# EAGLE design A601 (EAGLE 6.6.0)
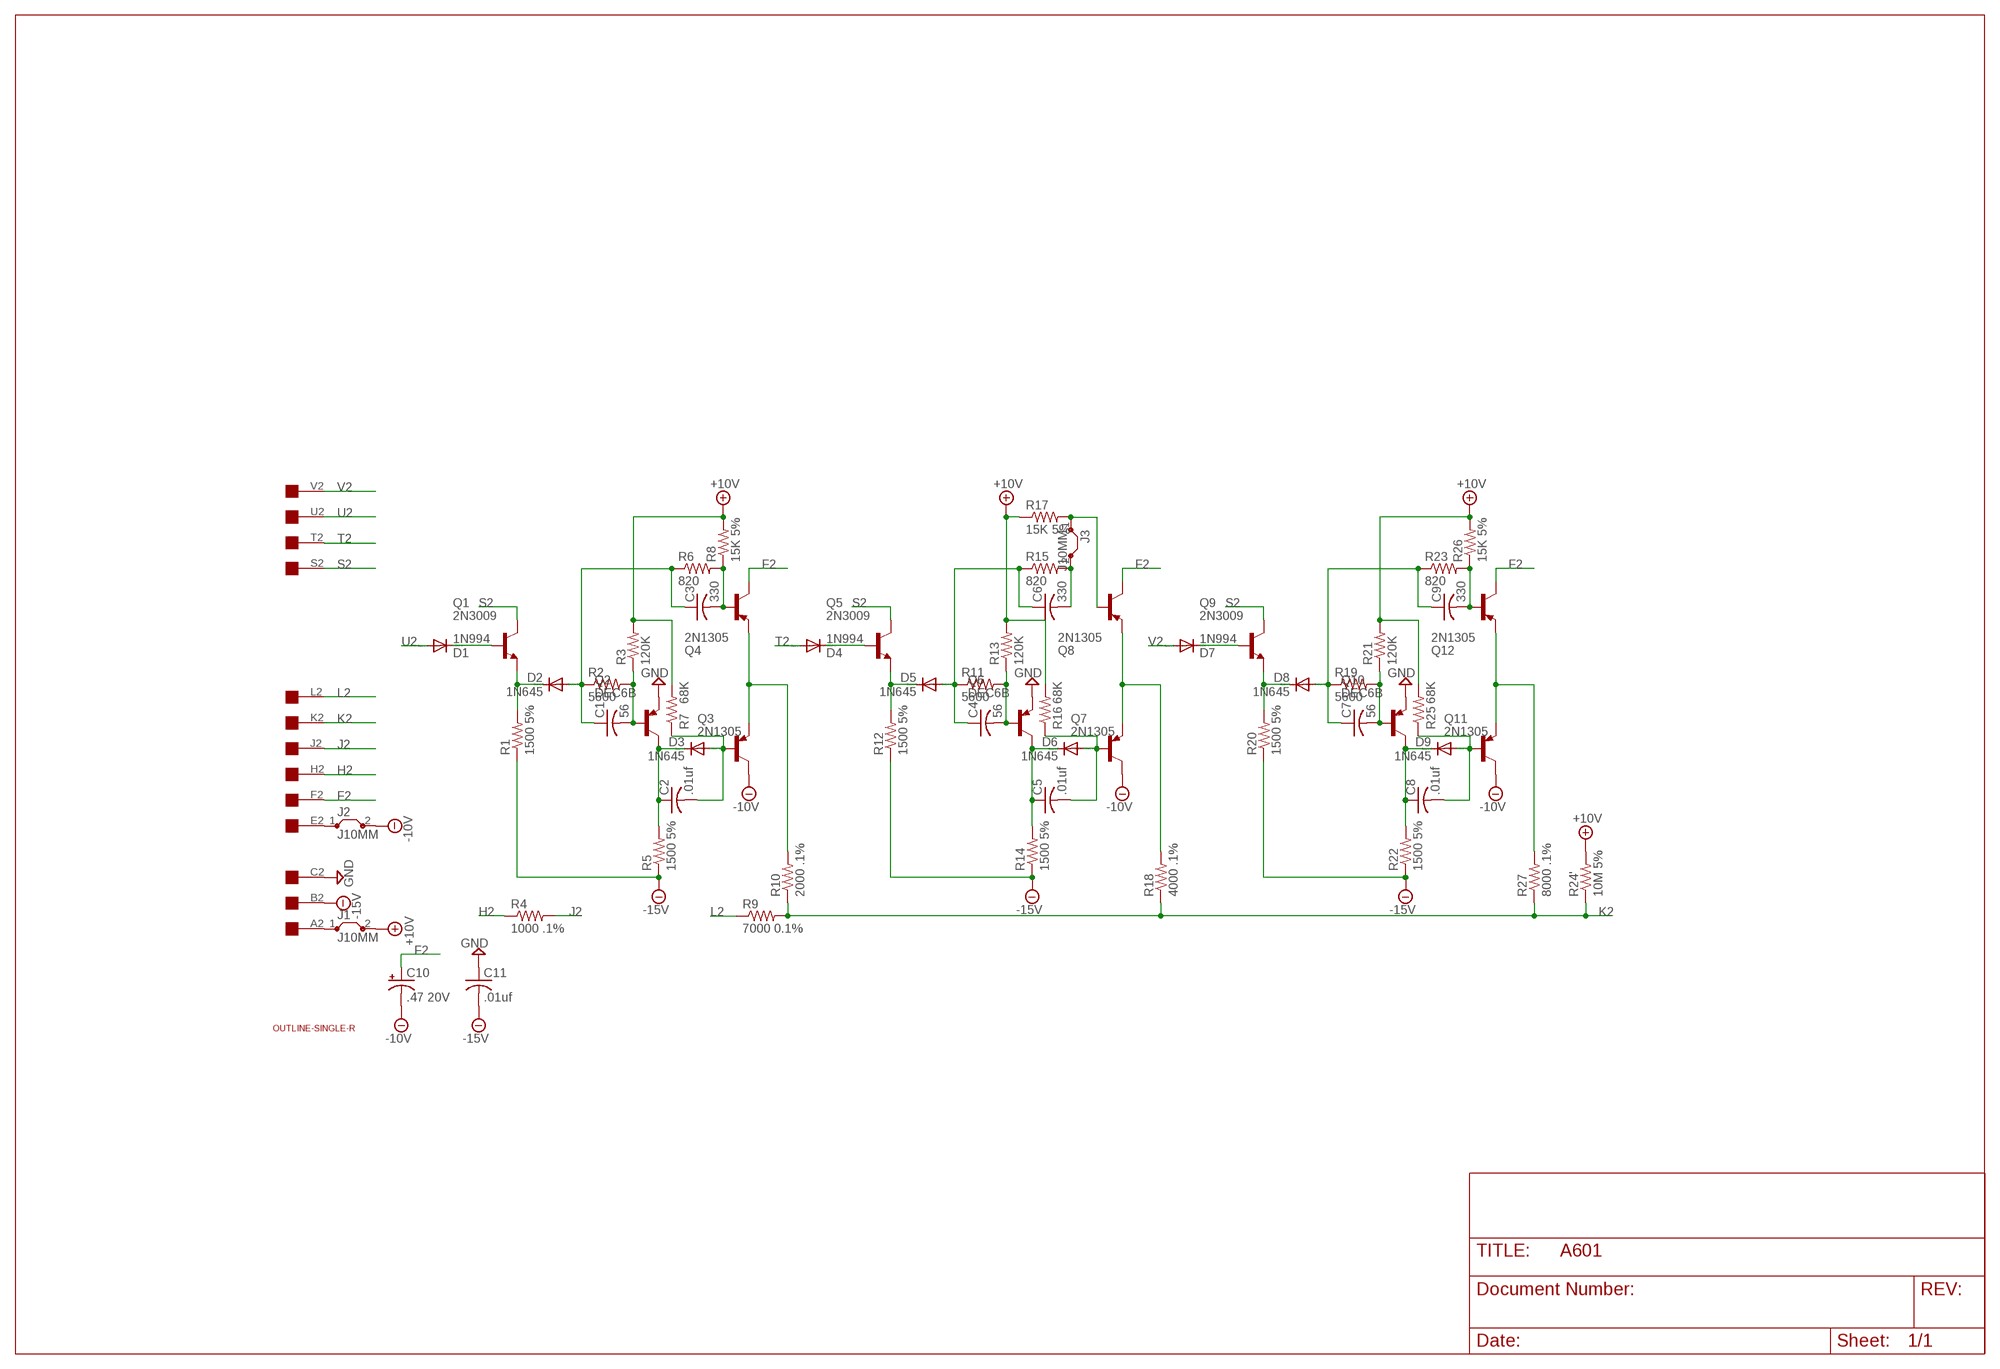
[diagram p0: schematic, sheet 1]

## Parts
C1  56  C-US075-032X103  [C075-032X103]
C2  .01uf  C-US050-025X075  [C050-025X075]
C3  330  C-US102-043X133  [C102-043X133]
C4  56  C-US075-032X103  [C075-032X103]
C5  .01uf  C-US050-025X075  [C050-025X075]
C6  330  C-US102-043X133  [C102-043X133]
C7  56  C-US075-032X103  [C075-032X103]
C8  .01uf  C-US050-025X075  [C050-025X075]
C9  330  C-US102-043X133  [C102-043X133]
C10  .47 20V  CPOL-USE22-6AXIAL  [E22-6]
C11  .01uf  C-US050-025X075  [C050-025X075]
D1  1N994  1N4148DO35-10  [DO35-10]
D2  1N645  1N4148DO35-10  [DO35-10]
D3  1N645  1N4148DO35-10  [DO35-10]
D4  1N994  1N4148DO35-10  [DO35-10]
D5  1N645  1N4148DO35-10  [DO35-10]
D6  1N645  1N4148DO35-10  [DO35-10]
D7  1N994  1N4148DO35-10  [DO35-10]
D8  1N645  1N4148DO35-10  [DO35-10]
D9  1N645  1N4148DO35-10  [DO35-10]
J1  J10MM  [10]
J2  J10MM  [10]
J3  J10MM  [10]
Q1  2N3009  2N1613-NPN-TO39-EBC  [TO39]
Q2  DEC6B  2N2904A  [TO39]
Q3  2N1305  2N2904A  [TO39]
Q4  2N1305  2N2904A  [TO39]
Q5  2N3009  2N1613-NPN-TO39-EBC  [TO39]
Q6  DEC6B  2N2904A  [TO39]
Q7  2N1305  2N2904A  [TO39]
Q8  2N1305  2N2904A  [TO39]
Q9  2N3009  2N1613-NPN-TO39-EBC  [TO39]
Q10  DEC6B  2N2904A  [TO39]
Q11  2N1305  2N2904A  [TO39]
Q12  2N1305  2N2904A  [TO39]
R1  1500 5%  R-US_0207/10  [0207/10]
R2  5600  R-US_0207/10  [0207/10]
R3  120K  R-US_0207/10  [0207/10]
R4  1000 .1%  R-US_0309/12  [0309/12]
R5  1500 5%  R-US_0207/10  [0207/10]
R6  820  R-US_0207/10  [0207/10]
R7  68K  R-US_0207/10  [0207/10]
R8  15K 5%  R-US_0207/10  [0207/10]
R9  7000 0.1%  R-US_0309/12  [0309/12]
R10  2000 .1%  R-US_0309/12  [0309/12]
R11  5600  R-US_0207/10  [0207/10]
R12  1500 5%  R-US_0207/10  [0207/10]
R13  120K  R-US_0207/10  [0207/10]
R14  1500 5%  R-US_0207/10  [0207/10]
R15  820  R-US_0207/10  [0207/10]
R16  68K  R-US_0207/10  [0207/10]
R17  15K 5%  R-US_0207/10  [0207/10]
R18  4000 .1%  R-US_0309/12  [0309/12]
R19  5600  R-US_0207/10  [0207/10]
R20  1500 5%  R-US_0207/10  [0207/10]
R21  120K  R-US_0207/10  [0207/10]
R22  1500 5%  R-US_0207/10  [0207/10]
R23  820  R-US_0207/10  [0207/10]
R24'  10M 5%  R-US_0207/10  [0207/10]
R25  68K  R-US_0207/10  [0207/10]
R26  15K 5%  R-US_0207/10  [0207/10]
R27  8000 .1%  R-US_0309/12  [0309/12]
U$2  OUTLINE-SINGLE-R  [SINGLE-R]
U$3  EDGE-1  [EDGE-CON1]

## Nets
+10V: J1.2 R3.2 R7.2 R8.2 R13.2 R16.2 R17.1 R21.2 R24'.2 R25.2 R26.2
-10V: C10.- J2.2 Q3.3(C) Q7.3(C) Q11.3(C)
-15V: C11.2 R1.1 R5.1 R12.1 R14.1 R20.1 R22.1 U$3.B2
F2: C10.+ Q4.3(C) Q8.3(C) Q12.3(C) U$3.F2
GND [supply]: C11.1 Q2.1(E) Q6.1(E) Q10.1(E) U$3.C2
H2: R4.1 U$3.H2
J2: R4.2 U$3.J2
K2: R9.2 R10.1 R18.1 R24'.1 R27.1 U$3.K2
L2: R9.1 U$3.L2
N$1: D1.C Q1.2(B)
N$2: D2.C Q1.1(E) R1.2
N$3: C1.1 C3.1 D2.A R2.1 R6.1
N$4: C1.2 Q2.2(B) R2.2 R3.1
N$5: C3.2 Q4.2(B) R6.2 R8.1
N$6: C2.1 D3.C Q2.3(C) R5.2
N$7: C2.2 D3.A Q3.2(B) R7.1
N$8: Q3.1(E) Q4.1(E) R10.2
N$9: J2.1 U$3.E2
N$10: D4.C Q5.2(B)
N$11: D5.C Q5.1(E) R12.2
N$12: C4.1 C6.1 D5.A R11.1 R15.1
N$13: C4.2 Q6.2(B) R11.2 R13.1
N$14: C6.2 J3.2 R15.2
N$15: C5.1 D6.C Q6.3(C) R14.2
N$16: C5.2 D6.A Q7.2(B) R16.1
N$17: Q7.1(E) Q8.1(E) R18.2
N$18: D7.C Q9.2(B)
N$19: D8.C Q9.1(E) R20.2
N$20: C7.1 C9.1 D8.A R19.1 R23.1
N$21: C7.2 Q10.2(B) R19.2 R21.1
N$22: C9.2 Q12.2(B) R23.2 R26.1
N$23: C8.1 D9.C Q10.3(C) R22.2
N$24: C8.2 D9.A Q11.2(B) R25.1
N$25: Q11.1(E) Q12.1(E) R27.2
N$26: J1.1 U$3.A2
N$27: J3.1 Q8.2(B) R17.2
S2: Q1.3(C) Q5.3(C) Q9.3(C) U$3.S2
T2: D4.A U$3.T2
U2: D1.A U$3.U2
V2: D7.A U$3.V2
Unconnected: U$3.D2 U$3.M2 U$3.N2 U$3.P2 U$3.R2

## Library data of the parts
C1-C9 C11 = rcl:C-US: CAPACITOR, American symbol
C10 = rcl:CPOL-US: POLARIZED CAPACITOR, American symbol
D1-D9 = diode:1N4148: DIODE high speed (Philips)
J1-J3 = jumper:J: Bridge
Q1 Q5 Q9 = transistor:*-NPN-: NPN Transistror BF959 corrected 2008.03.06
Q2-Q4 Q6-Q8 Q10-Q12 = transistor-pnp:2N2904*: PNP Transistror
R1-R23 R24' R25-R27 = rcl:R-US_: RESISTOR, American symbol
U$2 = dec-con:OUTLINE-*: Board outlines for DEC boards.
U$3 = dec-con:EDGE-1: Single-Sided DEC Edge Connector -- (side 2)

## Board
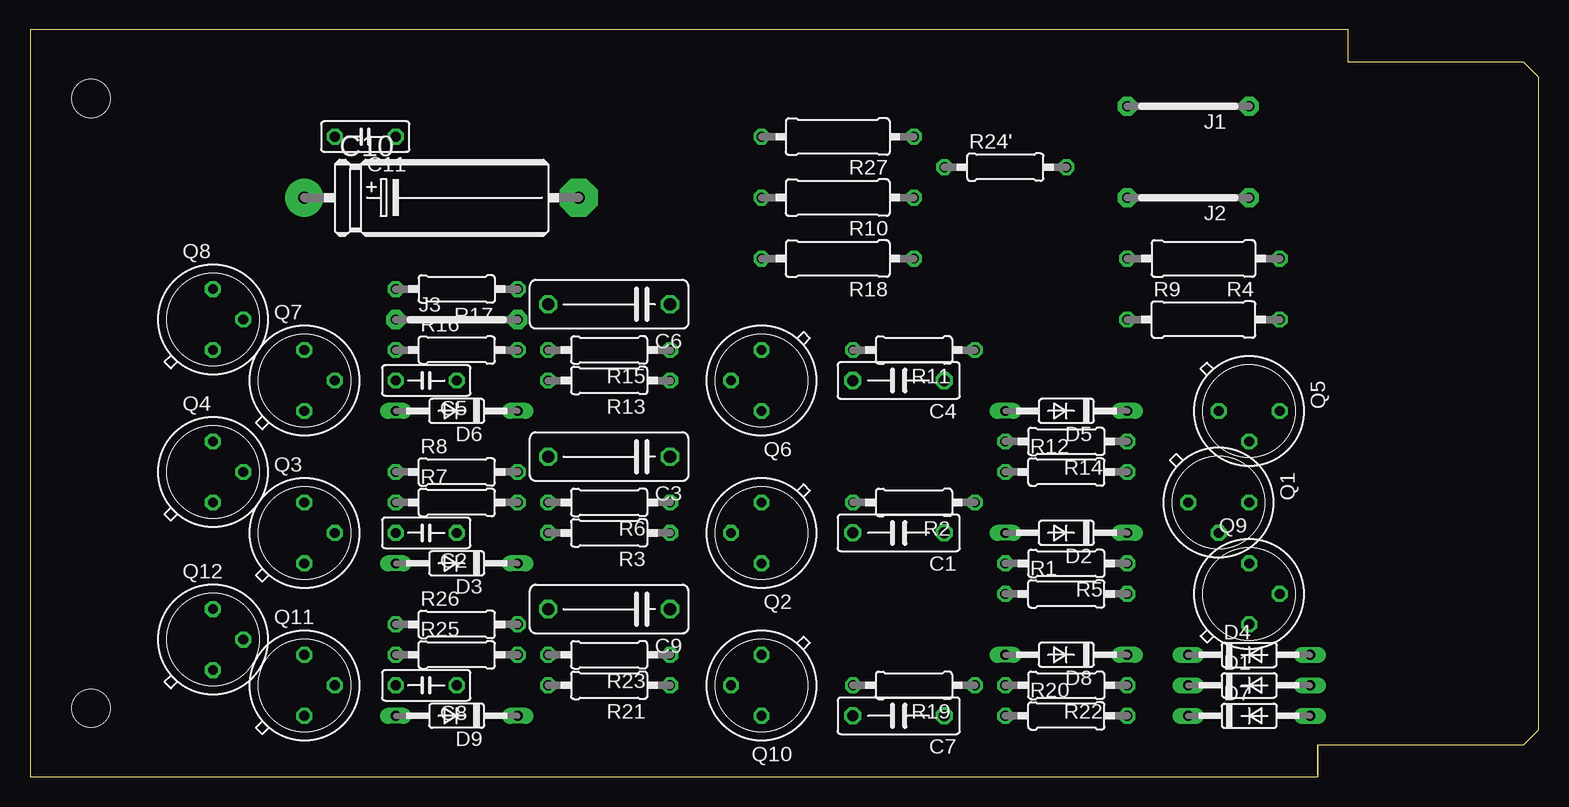
[diagram p1: board, top side]
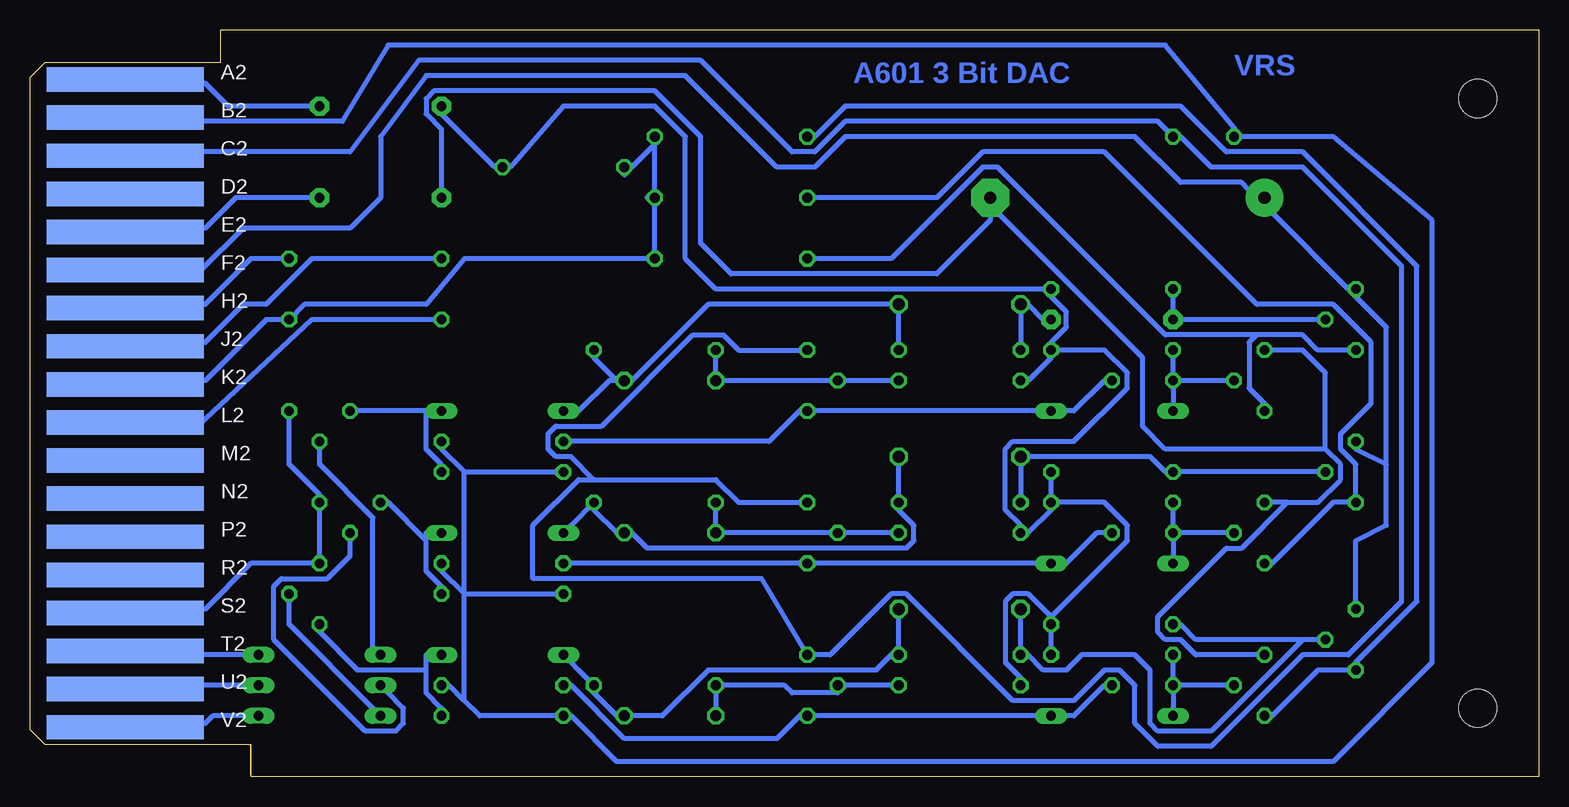
[diagram p2: board, bottom side, seen from below]

Size 125.73 x 62.23 mm. Coordinates in mm from the lower left corner, seen from the top.
Copper layers (1+16): Top 0.035mm / dielectric 1.5mm / Bottom 0.035mm
Design rules "16mils": minimum track width 16mil, minimum drill 32mil, track to track 15mil, track to pad 10mil, pad to pad 10mil, via to via 10mil, smd to smd 10mil, copper to edge 13mil, drill to drill 10mil, minimum pad ring 10mil, minimum via ring 8mil, stop-mask expansion 0mil, vias tented up to drill 0mil, thermal gap 10mil

### Footprints (pad centres in the part's own frame; a part is rotated, then mirrored left to right if it is on the bottom)
C075-032X103 = drill 0.914 octagon: 1 -3.81,0; 2 3.81,0
C050-025X075 = drill 0.813 octagon: 1 -2.54,0; 2 2.54,0
C102-043X133 = drill 1.016 octagon: 1 -5.08,0; 2 5.08,0
E22-6 = drill 1.016 pad 3.15: + -11.43,0 | drill 1.016 pad 3.15 octagon: - 11.43,0
DO35-10 = drill 0.813 long: A 5.08,0; C -5.08,0
10 = drill 0.813 pad 1.6 octagon: 1 -5.08,0; 2 5.08,0
TO39 = drill 0.813 octagon: 1 0,-2.54; 2 2.54,0; 3 0,2.54
0207/10 = drill 0.813 octagon: 1 -5.08,0; 2 5.08,0
0309/12 = drill 0.813 octagon: 1 -6.35,0; 2 6.35,0
SINGLE-R = hole 3.175: 5.08,5.715; 5.08,56.515
EDGE-CON1 = smd 13.106 x 2.032 bottom: A2 7.938,4.128; B2 7.938,7.303; C2 7.938,10.477; D2 7.938,13.652; E2 7.938,16.828; F2 7.938,20.003; H2 7.938,23.177; J2 7.938,26.352; K2 7.938,29.527; L2 7.938,32.703; M2 7.938,35.877; N2 7.938,39.053; P2 7.938,42.227; R2 7.938,45.403; S2 7.938,48.578; T2 7.938,51.752; U2 7.938,54.928; V2 7.938,58.102

### Placement (x,y rotation side)
C1  72.39,20.32 180 top
C2  33.02,20.32 180 top
C3  48.26,26.67 180 top
C4  72.39,33.02 180 top
C5  33.02,33.02 180 top
C6  48.26,39.37 180 top
C7  72.39,5.08 180 top
C8  33.02,7.62 180 top
C9  48.26,13.97 180 top
C10  34.29,48.26 0 top
C11  27.94,53.34 180 top
D1  101.6,7.62 0 top
D2  86.36,20.32 180 top
D3  35.56,17.78 180 top
D4  101.6,10.16 0 top
D5  86.36,30.48 180 top
D6  35.56,30.48 180 top
D7  101.6,5.08 0 top
D8  86.36,10.16 180 top
D9  35.56,5.08 180 top
J1  96.52,55.88 180 top
J2  96.52,48.26 180 top
J3  35.56,38.1 0 top
Q1  99.06,22.86 270 top
Q2  60.96,20.32 180 top
Q3  22.86,20.32 0 top
Q4  15.24,25.4 0 top
Q5  101.6,30.48 270 top
Q6  60.96,33.02 180 top
Q7  22.86,33.02 0 top
Q8  15.24,38.1 0 top
Q9  101.6,15.24 0 top
Q10  60.96,7.62 180 top
Q11  22.86,7.62 0 top
Q12  15.24,11.43 0 top
R1  86.36,15.24 0 top
R2  73.66,22.86 180 top
R3  48.26,20.32 180 top
R4  97.79,43.18 180 top
R5  86.36,17.78 180 top
R6  48.26,22.86 180 top
R7  35.56,22.86 0 top
R8  35.56,25.4 0 top
R9  97.79,38.1 0 top
R10  67.31,48.26 180 top
R11  73.66,35.56 180 top
R12  86.36,25.4 0 top
R13  48.26,33.02 180 top
R14  86.36,27.94 180 top
R15  48.26,35.56 180 top
R16  35.56,35.56 0 top
R17  35.56,40.64 180 top
R18  67.31,43.18 180 top
R19  73.66,7.62 180 top
R20  86.36,5.08 0 top
R21  48.26,7.62 180 top
R22  86.36,7.62 180 top
R23  48.26,10.16 180 top
R24'  81.28,50.8 0 top
R25  35.56,10.16 0 top
R26  35.56,12.7 0 top
R27  67.31,53.34 180 top
U$2  0,0 0 top
U$3  125.73,62.23 180 top

### Tracks (layer width: path | path; a pad name or v marks a point on that pad's centre or on a via)
+10V
  Bottom 0.406: R25.2 40.64,10.79 40.64,12.06 R26.2 | 40.64,13.34 42.55,15.24 43.81,15.24 44.45,14.61 44.45,9.53 43.18,8.26 R21.2 | R26.2 40.64,13.34 | R7.2 40.64,23.5 40.64,24.77 R8.2 | R7.2 40.64,22.23 42.55,20.32 R3.2 43.18,20.95 44.45,22.23 44.45,27.3 43.81,27.94 38.73,27.94 34.29,32.38 34.29,33.66 36.2,35.56 40.01,35.56 R16.2 | R13.2 42.55,33.02 40.64,34.92 R16.2 | R16.2 40.64,36.2 39.37,37.47 39.37,38.73 40.64,40.01 R17.1 41.27,40.64 55.24,40.64 55.88,40.64 68.58,40.64 71.12,43.18 71.12,53.34 73.66,55.88 81.28,55.88 85.72,50.8 R24'.2 87,50.8 91.44,55.24 J1.2 | 40.64,13.34 34.29,19.68 34.29,20.95 36.2,22.86 40.01,22.86 R7.2 | R26.2 40.64,13.34
-10V
  Bottom 0.406: 17.78,27.3 31.11,27.3 33.02,29.21 33.02,34.92 45.09,46.99 C10.- 45.72,46.35 50.16,41.91 67.31,41.91 69.85,44.45 69.85,53.34 73.66,57.15 92.08,57.15 92.71,56.52 92.71,55.24 91.44,53.98 J2.2 | 17.78,27.3 16.51,26.04 16.51,24.77 18.41,22.86 20.95,22.86 | 20.95,22.86 Q3.3 | Q11.3 28.57,10.16 29.84,11.43 31.11,11.43 31.75,12.06 31.75,13.34 26.04,19.05 24.77,19.05 20.95,22.86 | 17.78,27.3 17.78,33.66 19.68,35.56 Q7.3
-15V
  Bottom 0.406: 89.53,6.35 90.81,7.62 R22.1 | 89.53,6.35 88.27,5.08 R20.1 80.64,5.08 76.83,1.27 17.14,1.27 8.89,9.53 8.89,46.35 17.14,53.34 24.77,53.34 | 89.53,15.24 91.44,17.14 R5.1 | 89.53,6.35 89.53,15.24 | 89.53,25.4 91.44,27.3 R14.1 | 89.53,15.24 89.53,25.4 | 24.77,53.34 31.11,60.96 95.89,60.96 99.69,54.61 111.76,54.61 U$3.B2 | 89.53,15.24 R1.1 | 89.53,25.4 R12.1 | 24.77,53.34 C11.2
F2
  Bottom 0.406: Q12.3 15.24,19.68 12.7,20.95 12.7,26.04 | 12.7,26.04 15.24,27.3 Q4.3 | 12.7,26.04 12.7,37.47 15.24,40.01 Q8.3 15.88,40.64 22.23,46.99 C10.+ 24.13,48.9 24.77,49.53 29.84,49.53 33.66,53.34 57.78,53.34 60.33,50.8 63.5,50.8 71.12,58.42 92.71,58.42 96.52,53.34 96.52,48.26 99.06,45.72 107.95,45.72 111.48,42.19 U$3.F2
GND
  Bottom 0.406: U$3.C2 111.76,52.07 99.06,52.07 93.34,59.69 69.85,59.69 62.23,52.07 60.33,52.07 57.78,54.61 31.75,54.61 C11.1 29.84,53.34 27.3,50.8 19.68,50.8 11.43,42.55 11.43,14.61 15.88,10.16 19.68,10.16 27.3,2.54 31.75,2.54 33.66,4.45 33.66,7.62 34.92,8.89 36.2,8.89 38.73,6.35 43.81,6.35 52.7,15.24 53.98,15.24 59.05,10.16 Q10.1 64.77,16.51 83.82,16.51 83.82,20.95 80.01,24.77 78.74,24.77 | Q2.1 66.67,22.86 68.58,24.77 78.74,24.77 | Q6.1 66.67,35.56 67.94,36.83 70.48,36.83 78.11,29.21 81.92,29.21 82.55,28.57 82.55,27.3 81.92,26.67 80.64,26.67 78.74,24.77
H2
  Bottom 0.406: R4.1 107.31,43.18 111.12,39.37 U$3.H2
J2
  Bottom 0.406: R4.2 102.23,43.18 106.05,39.37 107.95,39.37 111.12,36.2 U$3.J2
K2
  Bottom 0.406: 73.66,47.62 73.66,52.7 | 76.2,50.16 R24'.1 75.56,50.8 73.66,52.7 | 74.3,48.26 R10.1 R18.1 89.53,43.18 92.71,39.37 102.87,39.37 R9.2 106.05,38.1 111.12,33.02 U$3.K2 | 73.66,52.7 R27.1
L2
  Bottom 0.406: R9.1 102.23,38.1 111.76,29.21 U$3.L2
N$1
  Bottom 0.406: D1.C 95.89,6.99 94.61,5.71 94.61,4.45 95.25,3.81 97.79,3.81 105.41,11.43 105.41,15.88 104.78,16.51 100.97,16.51 99.06,18.41 99.06,19.68 Q1.2
N$2
  Bottom 0.406: 92.71,19.68 92.71,20.32 D2.C | 92.71,19.68 92.71,17.14 91.44,15.88 R1.2 | 92.71,19.68 95.89,22.86 Q1.1
N$3
  Bottom 0.406: C3.1 53.34,26.04 53.34,23.5 R6.1 53.34,22.23 52.07,20.95 52.07,19.68 52.7,19.05 74.3,19.05 75.56,20.32 C1.1 76.83,20.32 78.74,22.23 R2.1 80.64,20.95 D2.A
N$4
  Bottom 0.406: R2.2 68.58,22.23 68.58,20.95 C1.2 67.94,20.32 59.05,20.32 Q2.2 57.78,20.32 53.98,20.32 R3.1
N$5
  Bottom 0.406: R6.2 43.18,23.5 43.18,26.04 C3.2 42.55,26.67 32.38,26.67 31.11,25.4 R8.1 29.84,25.4 18.41,25.4 Q4.2
N$6
  Bottom 0.406: C2.1 36.2,20.32 36.83,20.32 39.37,17.78 D3.C 41.91,17.78 60.33,17.78 Q2.3 61.59,17.78 80.64,17.78 R5.2
N$7
  Bottom 0.406: Q3.2 26.04,20.32 29.84,20.32 C2.2 | D3.A 30.48,18.41 30.48,19.68 C2.2 | R7.1 30.48,22.23 30.48,20.95 C2.2
N$8
  Bottom 0.406: Q3.1 22.23,17.78 17.14,22.86 Q4.1 15.24,26.04 16.51,27.3 16.51,28.57 13.97,31.11 13.97,36.2 17.14,39.37 23.5,39.37 36.2,52.07 46.35,52.07 50.16,48.26 R10.2
N$9
  Bottom 0.406: J2.1 108.58,48.26 111.12,45.72 U$3.E2
N$10
  Bottom 0.406: D4.C 97.16,10.79 97.16,21.59 101.6,26.04 101.6,27.3 Q5.2
N$11
  Bottom 0.406: 92.71,30.48 92.71,27.3 91.44,26.04 R12.2 | 92.71,30.48 D5.C 92.71,30.48 | 92.71,30.48 98.42,30.48 Q5.1
N$12
  Bottom 0.406: R15.1 53.34,36.2 53.34,38.73 C6.1 53.98,39.37 69.22,39.37 75.56,33.02 C4.1 | 76.83,33.02 77.47,33.02 80.01,30.48 D5.A | C4.1 76.83,33.02 | 76.83,33.02 78.74,34.92 R11.1 | C4.1 76.83,33.02
N$13
  Bottom 0.406: R11.2 68.58,34.92 68.58,33.66 C4.2 67.94,33.02 59.05,33.02 Q6.2 57.78,33.02 53.98,33.02 R13.1
N$14
  Bottom 0.406: R15.2 43.18,36.2 43.18,38.73 C6.2 42.55,39.37 41.27,38.1 J3.2
N$15
  Bottom 0.406: C5.1 36.2,33.02 38.73,30.48 39.37,30.48 D6.C 41.91,30.48 60.33,30.48 Q6.3 61.59,30.48 64.14,27.94 80.64,27.94 R14.2
N$16
  Bottom 0.406: Q7.2 26.04,33.02 29.84,33.02 C5.2 | D6.A 30.48,31.11 30.48,32.38 C5.2 | R16.1 30.48,34.92 30.48,33.66 C5.2
N$17
  Bottom 0.406: 23.5,36.83 19.68,36.83 18.41,35.56 15.88,35.56 Q8.1 | 23.5,36.83 24.13,36.2 24.13,32.38 22.86,31.11 Q7.1 | 23.5,36.83 31.11,36.83 45.09,50.8 46.35,50.8 53.98,43.18 57.78,43.18 60.33,43.18 R18.2
N$18
  Bottom 0.406: D7.C 97.16,5.71 104.14,12.7 104.14,14.61 Q9.2
N$19
  Bottom 0.406: 92.71,8.89 92.71,10.16 D8.C | 92.71,8.89 92.71,6.99 91.44,5.71 R20.2 | 92.71,8.89 98.42,8.89 101.6,12.06 Q9.1
N$20
  Bottom 0.406: D8.A 80.64,9.53 80.01,8.89 R19.1 78.74,6.99 76.83,5.08 C7.1 75.56,5.08 73.03,5.08 69.22,8.89 55.24,8.89 53.98,10.16 R23.1 53.34,10.79 53.34,13.34 C9.1
N$21
  Bottom 0.406: C7.2 68.58,5.71 68.58,6.99 R19.2 67.94,7.62 62.87,7.62 62.23,6.99 58.42,6.99 Q10.2 57.78,7.62 53.98,7.62 R21.1
N$22
  Bottom 0.406: C9.2 43.18,13.34 43.18,10.79 R23.2 42.55,10.16 41.27,8.89 39.37,8.89 38.1,10.16 33.66,10.16 32.38,8.89 32.38,4.45 31.75,3.81 27.3,3.81 19.68,11.43 | 19.68,11.43 28.57,11.43 29.84,12.7 R26.1 | 19.68,11.43 18.41,11.43 Q12.2
N$23
  Bottom 0.406: C8.1 36.2,7.62 38.73,5.08 39.37,5.08 D9.C 41.91,5.08 60.33,5.08 Q10.3 61.59,5.08 63.5,3.17 76.2,3.17 80.64,7.62 R22.2
N$24
  Bottom 0.406: Q11.2 26.04,7.62 29.84,7.62 C8.2 | D9.A 30.48,5.71 30.48,6.99 C8.2 | R25.1 30.48,9.53 30.48,8.26 C8.2
N$25
  Bottom 0.406: Q11.1 22.23,5.08 18.41,8.89 Q12.1 15.24,9.53 10.16,14.61 10.16,42.55 19.68,52.07 26.04,52.07 29.84,55.88 57.78,55.88 60.33,53.34 R27.2
N$26
  Bottom 0.406: J1.1 109.22,55.88 111.12,57.78 U$3.A2
N$27
  Bottom 0.406: Q8.2 18.41,38.1 29.84,38.1 J3.1 30.48,38.73 30.48,40.01 R17.2
S2
  Bottom 0.406: Q5.3 104.14,26.04 101.6,23.5 Q1.3 Q9.3 107.31,17.78 111.12,13.97 U$3.S2
T2
  Bottom 0.406: D4.A 107.95,10.16 111.76,10.16 U$3.T2
U2
  Bottom 0.406: D1.A 107.95,7.62 111.76,7.62 U$3.U2
V2
  Bottom 0.406: D7.A 110.49,5.08 111.12,4.45 U$3.V2

### Text on the board
Bottom: VRS | A601 3 Bit DAC